# EAGLE schematic SyncScan Standalone MK3 PTH (EAGLE 6.2)
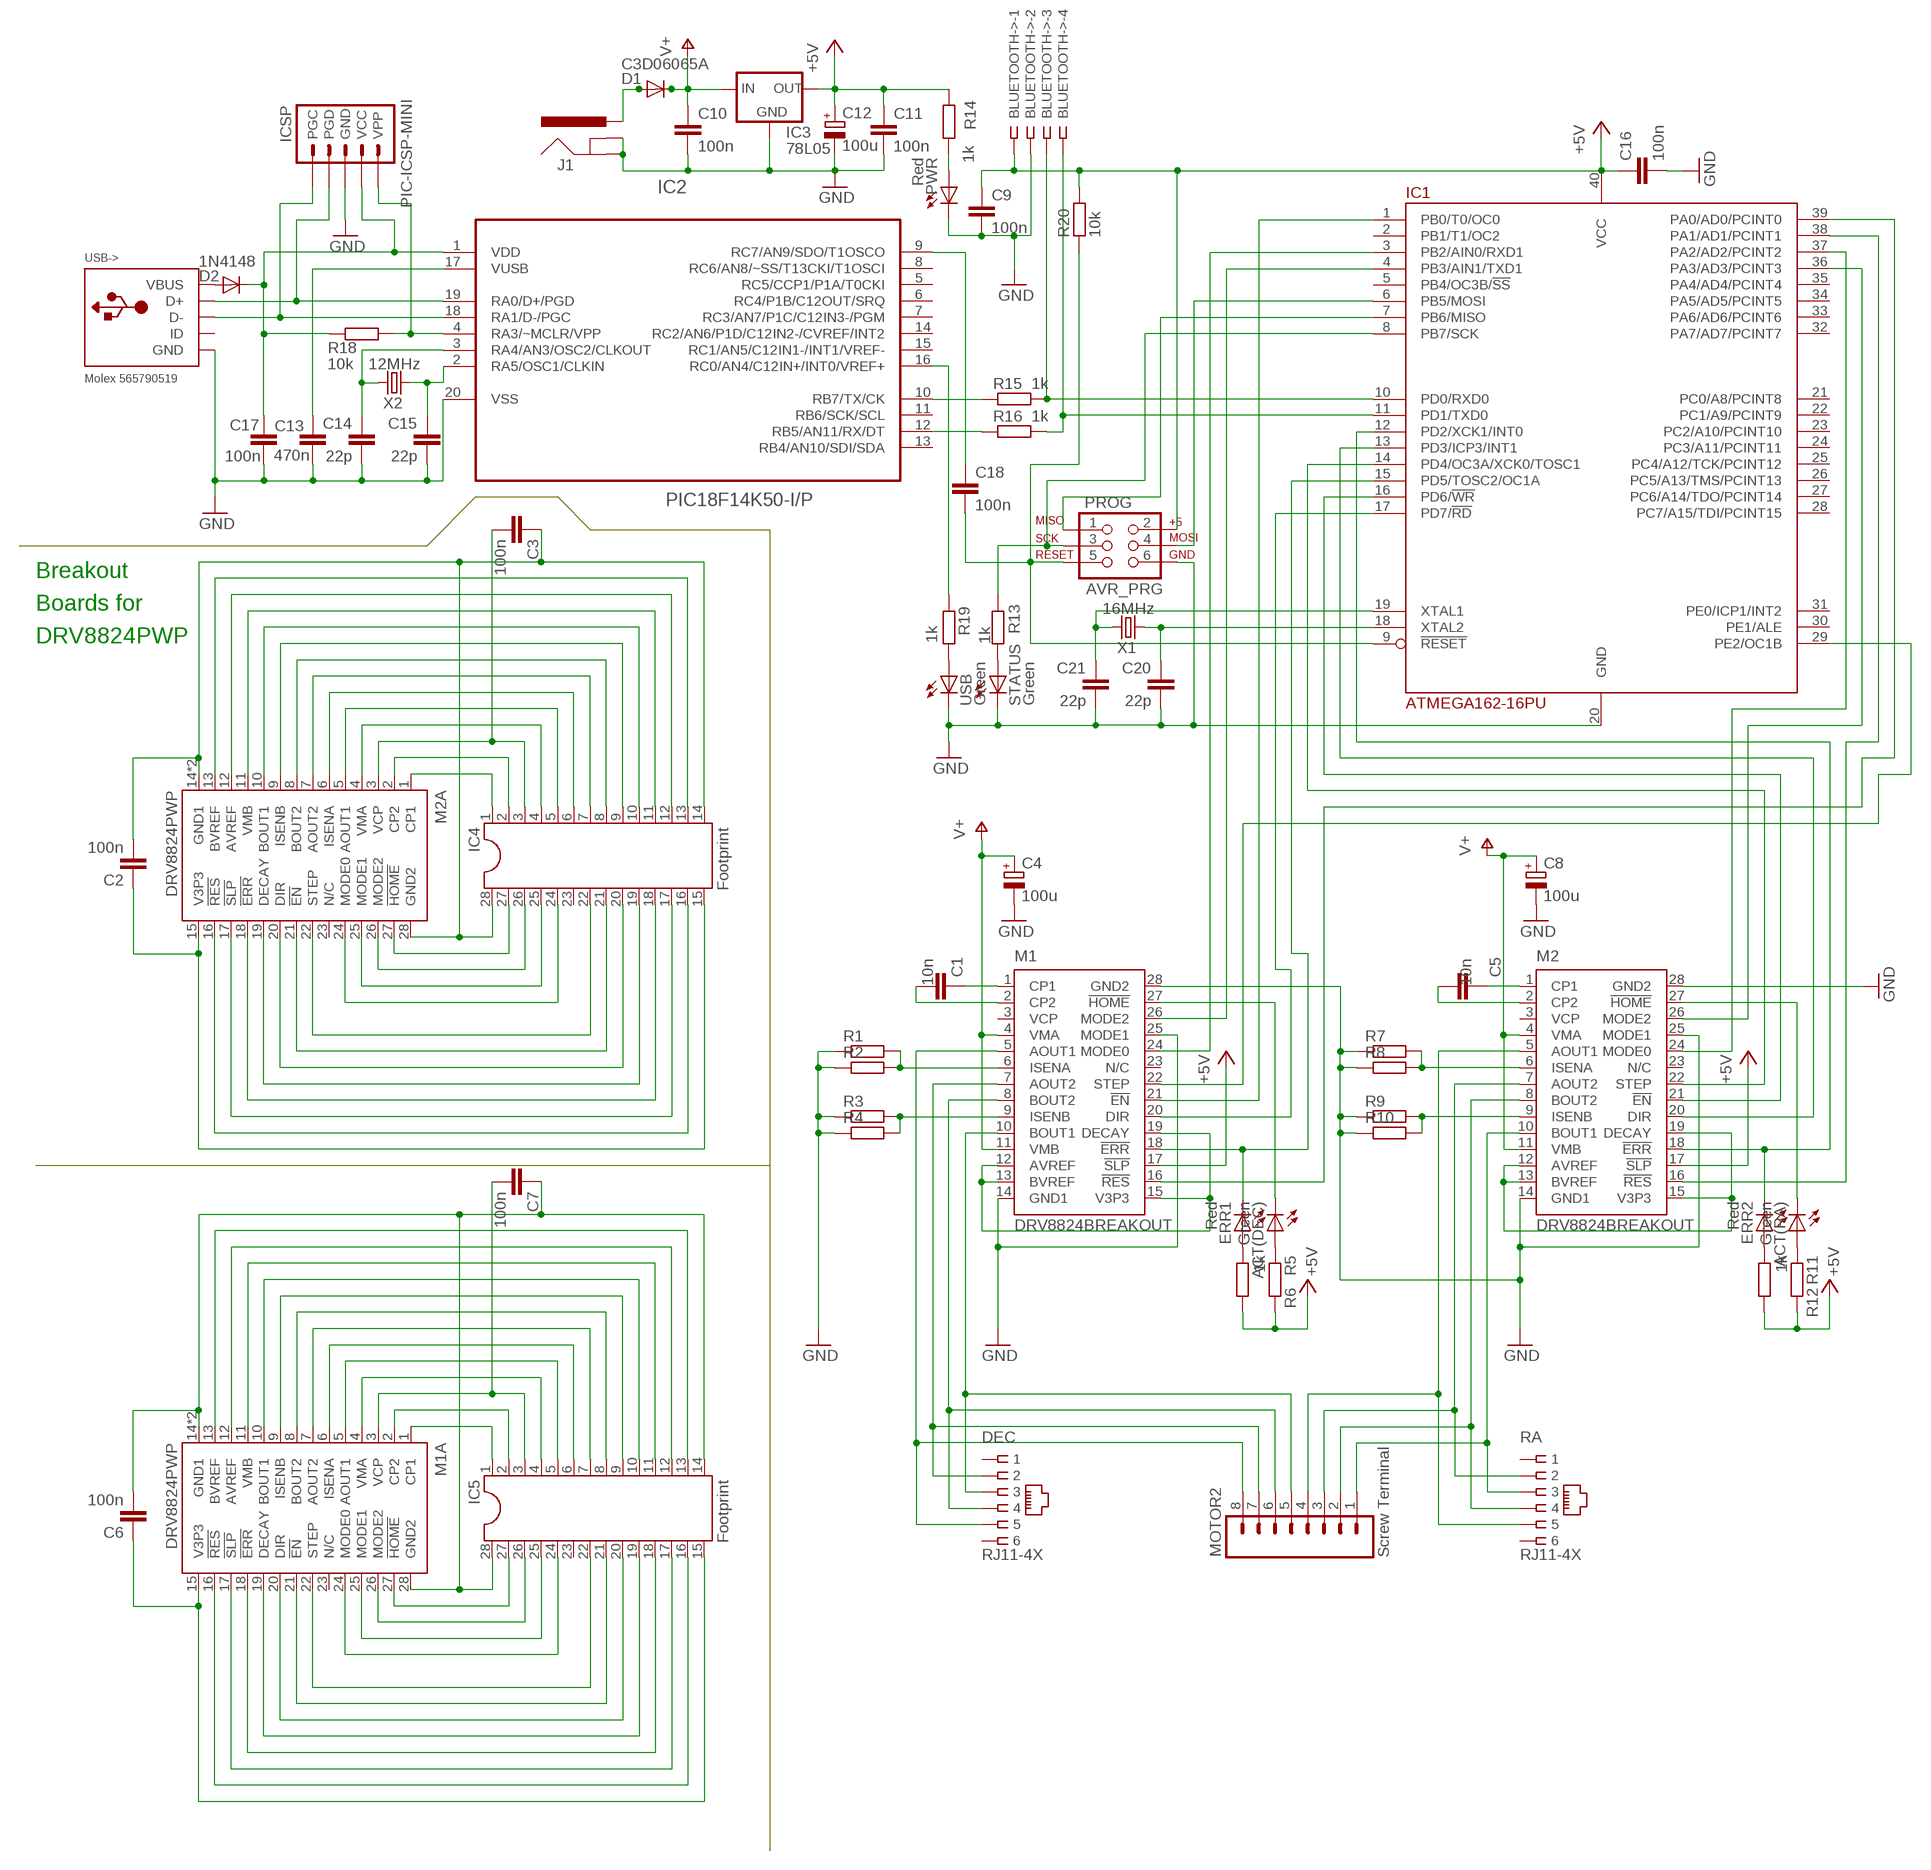
[diagram p0: schematic, sheet 1]

## Parts
ACT(DEC)  Green  LED3MM  [LED3MM]
ACT(RA)  Green  LED3MM  [LED3MM]
BLUETOOTH->  http://www.ebay.co.uk/itm/250991624201  SSW-104-02-S-S-RA  [SSW-104-02-S-S-RA]
C1  10n  C-EU025-024X044  [C025-024X044]
C2  100n  C-EUC0603K  [C0603K]
C3  100n  C-EUC0603K  [C0603K]
C4  100u  CPOL-EUE2.5-6  [E2,5-6]
C5  10n  C-EU025-024X044  [C025-024X044]
C6  100n  C-EUC0603K  [C0603K]
C7  100n  C-EUC0603K  [C0603K]
C8  100u  CPOL-EUE2.5-6  [E2,5-6]
C9  100n  C-EU025-024X044  [C025-024X044]
C10  100n  C-EU025-024X044  [C025-024X044]
C11  100n  C-EU025-024X044  [C025-024X044]
C12  100u  CPOL-EUE2.5-6  [E2,5-6]
C13  470n  C-EU025-024X044  [C025-024X044]
C14  22p  C-EU025-024X044  [C025-024X044]
C15  22p  C-EU025-024X044  [C025-024X044]
C16  100n  C-EU025-024X044  [C025-024X044]
C17  100n  C-EU025-024X044  [C025-024X044]
C18  100n  C-EU025-024X044  [C025-024X044]
C20  22p  C-EU025-024X044  [C025-024X044]
C21  22p  C-EU025-024X044  [C025-024X044]
D1  C3D06065A  BYW80  [TO220ACS]
D2  1N4148  DIODE1N4148  [DIODE-1N4148]
DEC  RJ11-4X  [RJ11-NO_SHIELD]
ERR1  Red  LED3MM  [LED3MM]
ERR2  Red  LED3MM  [LED3MM]
IC1  ATMEGA162-16PU  [DIL40]
IC2  PIC18F14K50-I/P  [DIL20]
IC3  78L05  V_REG_78XXTO-92  [TO-92]
IC4  Footprint  DIL28  [DIL28-6]
IC5  Footprint  DIL28  [DIL28-6]
ICSP  PIC-ICSP-MINI  [PIC-ICSP-MINI]
J1  POWER_JACKPTH  [POWER_JACK_PTH]
M1  DRV8824BREAKOUT  [DIL28-6]
M1A  DRV8824PWP  [HTSSOP28PWP]
M2  DRV8824BREAKOUT  [DIL28-6]
M2A  DRV8824PWP  [HTSSOP28PWP]
MOTOR2  Screw Terminal  M083.5MM-8  [SCREWTERMINAL-3.5MM-8]
PROG  AVR_PRG  AVR_SPI_PRG_6PTH  [2X3]
PWR  Red  LED3MM  [LED3MM]
R1  1.5R  R-EU_0309/12  [0309/12]
R2  1.5R  R-EU_0309/12  [0309/12]
R3  1.5R  R-EU_0309/12  [0309/12]
R4  1.5R  R-EU_0309/12  [0309/12]
R5  1k  R-EU_0204/7  [0204/7]
R6  1k  R-EU_0204/7  [0204/7]
R7  1.5R  R-EU_0309/12  [0309/12]
R8  1.5R  R-EU_0309/12  [0309/12]
R9  1.5R  R-EU_0309/12  [0309/12]
R10  1.5R  R-EU_0309/12  [0309/12]
R11  1k  R-EU_0204/7  [0204/7]
R12  1k  R-EU_0204/7  [0204/7]
R13  1k  R-EU_0204/7  [0204/7]
R14  1k  R-EU_0204/7  [0204/7]
R15  1k  R-EU_0204/7  [0204/7]
R16  1k  R-EU_0204/7  [0204/7]
R18  10k  R-EU_0204/7  [0204/7]
R19  1k  R-EU_0204/7  [0204/7]
R20  10k  R-EU_0204/7  [0204/7]
RA  RJ11-4X  [RJ11-NO_SHIELD]
STATUS  Green  LED3MM  [LED3MM]
USB  Green  LED3MM  [LED3MM]
USB->  Molex 565790519  USBMOLEX  [USB-MINIB-THM-MOLEX]
X1  16MHz  CRYSTALHC49US  [HC49US]
X2  12MHz  CRYSTALHC49US  [HC49US]

## Nets
3.3V-1: M1.12(AVREF) M1.13(BVREF) M1.15(V3P3) M1.19(DECAY)
3.3V-2: M2.12(AVREF) M2.13(BVREF) M2.15(V3P3) M2.19(DECAY)
!EN: IC4.21 M2A.21(!EN)
!EN1: IC5.21 M1A.21(!EN)
!EN-1: IC1.1(PB0/T0/OC0) M1.21(!EN)
!EN-2: IC1.16(PD6/!WR) M2.21(!EN)
!ERR: IC4.18 M2A.18(!ERR)
!ERR1: IC5.18 M1A.18(!ERR)
!ERR-1: ERR1.K(C) IC1.15(PD5/TOSC2/OC1A) M1.18(!ERR)
!ERR-2: ERR2.K(C) IC1.12(PD2/XCK1/INT0) M2.18(!ERR)
!HOME: IC4.27 M2A.27(!HOME)
!HOME1: IC5.27 M1A.27(!HOME)
!HOME-1: ACT(DEC).K(C) M1.27(!HOME)
!HOME-2: ACT(RA).K(C) M2.27(!HOME)
!RES: IC4.16 M2A.16(!RES)
!RES1: IC5.16 M1A.16(!RES)
!RST-1: IC1.39(PA0/AD0/PCINT0) M1.16(!RES)
!RST-2: IC1.38(PA1/AD1/PCINT1) M2.16(!RES)
!SLP: IC4.17 M2A.17(!SLP)
!SLP1: IC5.17 M1A.17(!SLP)
+5V: BLUETOOTH->.1 C9.1 C11.1 C12.+ C16.1 IC1.40(VCC) IC3.1(OUT) M1.17(!SLP) M2.17(!SLP) PROG.2 R5.2 R6.2 R11.2 R12.2 R14.1 R20.2
A1-1: DEC.5 M1.5(AOUT1) MOTOR2.8
A1-2: M2.5(AOUT1) MOTOR2.4 RA.5
A2-1: DEC.2 M1.7(AOUT2) MOTOR2.7
A2-2: M2.7(AOUT2) MOTOR2.3 RA.2
AOUT1: IC4.5 M2A.5(AOUT1)
AOUT2: IC4.7 M2A.7(AOUT2)
AOUT3: IC5.5 M1A.5(AOUT1)
AOUT4: IC5.7 M1A.7(AOUT2)
AVREF: IC4.12 M2A.12(AVREF)
AVREF1: IC5.12 M1A.12(AVREF)
AVROSC1: C21.1 IC1.19(XTAL1) X1.2
AVROSC2: C20.1 IC1.18(XTAL2) X1.1
B1-1: DEC.3 M1.10(BOUT1) MOTOR2.5
B1-2: M2.10(BOUT1) MOTOR2.1 RA.3
B2-1: DEC.4 M1.8(BOUT2) MOTOR2.6
B2-2: M2.8(BOUT2) MOTOR2.2 RA.4
BOUT1: IC4.10 M2A.10(BOUT1)
BOUT2: IC4.8 M2A.8(BOUT2)
BOUT3: IC5.8 M1A.8(BOUT2)
BOUT4: IC5.10 M1A.10(BOUT1)
BVREF: IC4.13 M2A.13(BVREF)
BVREF1: IC5.13 M1A.13(BVREF)
CP1: IC4.1 M2A.1(CP1)
CP1-1: C1.1 M1.1(CP1)
CP1-2: C5.1 M2.1(CP1)
CP2: IC4.2 M2A.2(CP2)
CP2-1: C1.2 M1.2(CP2)
CP2-2: C5.2 M2.2(CP2)
CP3: IC5.1 M1A.1(CP1)
CP4: IC5.2 M1A.2(CP2)
D+: IC2.19(RA0/D+/PGD) ICSP.4(PGD) USB->.D+
D-: IC2.18(RA1/D-/PGC) ICSP.5(PGC) USB->.D-
DECAY: IC4.19 M2A.19(DECAY)
DECAY1: IC5.19 M1A.19(DECAY)
DIR: IC4.20 M2A.20(DIR)
DIR1: IC5.20 M1A.20(DIR)
DIR-1: IC1.17(PD7/!RD) M1.20(DIR)
DIR-2: IC1.13(PD3/ICP3/INT1) M2.20(DIR)
GND: BLUETOOTH->.2 C4.- C8.- C9.2 C10.2 C11.2 C12.- C13.1 C14.2 C15.2 C16.2 C17.2 C20.2 C21.2 IC1.20(GND) IC2.20(VSS) IC3.2(GND) ICSP.3(GND) J1.GND J1.GNDBREAK M1.14(GND1) M1.25(MODE1) M1.28(GND2) M2.14(GND1) M2.25(MODE1) M2.28(GND2) PROG.6 PWR.K(C) R1.1 R2.1 R3.1 R4.1 R7.1 R8.1 R9.1 R10.1 STATUS.K(C) USB->.GND USB.K(C)
GND1: C6.2 C7.1 IC5.14 IC5.28 M1A.14(GND1) M1A.28(GND2) M1A.EXP(GND1)
GND2: C2.2 C3.1 IC4.14 IC4.28 M2A.14(GND1) M2A.28(GND2) M2A.EXP(GND1)
ISENA: IC4.6 M2A.6(ISENA)
ISENA1: IC5.6 M1A.6(ISENA)
ISENA-1: M1.6(ISENA) R1.2 R2.2
ISENA-2: M2.6(ISENA) R7.2 R8.2
ISENB: IC4.9 M2A.9(ISENB)
ISENB1: IC5.9 M1A.9(ISENB)
ISENB-1: M1.9(ISENB) R3.2 R4.2
ISENB-2: M2.9(ISENB) R9.2 R10.2
LED1: ERR1.A R6.1
LED2: ACT(DEC).A R5.1
LED3: ERR2.A R12.1
LED4: ACT(RA).A R11.1
M0-1: IC1.3(PB2/AIN0/RXD1) M1.24(MODE0)
M0-2: IC1.37(PA2/AD2/PCINT2) M2.24(MODE0)
M2-1: IC1.4(PB3/AIN1/TXD1) M1.26(MODE2)
M2-2: IC1.36(PA3/AD3/PCINT3) M2.26(MODE2)
MCLR: IC2.4(RA3/~MCLR/VPP) ICSP.1(VPP) R18.1
MISO: IC1.7(PB6/MISO) PROG.1
MODE0: IC4.24 M2A.24(MODE0)
MODE1: IC4.25 M2A.25(MODE1)
MODE2: IC4.26 M2A.26(MODE2)
MODE3: IC5.24 M1A.24(MODE0)
MODE4: IC5.25 M1A.25(MODE1)
MODE5: IC5.26 M1A.26(MODE2)
MOSI: IC1.6(PB5/MOSI) PROG.4
N$1: C18.1 IC2.9(RC7/AN9/SDO/T1OSCO)
PWRLED: PWR.A R14.2
RESET: C18.2 IC1.9(!RESET) PROG.5 R20.1
RX(BTH): BLUETOOTH->.4 IC1.11(PD1/TXD0) R16.1
RX(USB): IC2.12(RB5/AN11/RX/DT) R16.2
SCLK: IC1.8(PB7/SCK) PROG.3 R13.1
STATLED: R13.2 STATUS.A
STEP: IC4.22 M2A.22(STEP)
STEP1: IC5.22 M1A.22(STEP)
STEP-1: IC1.29(PE2/OC1B) M1.22(STEP)
STEP-2: IC1.14(PD4/OC3A/XCK0/TOSC1) M2.22(STEP)
TX(BTH): BLUETOOTH->.3 IC1.10(PD0/RXD0) R15.1
TX(USB): IC2.10(RB7/TX/CK) R15.2
USBLED: R19.1 USB.A
USBOSC1: C15.1 IC2.2(RA5/OSC1/CLKIN) X2.1
USBOSC2: C14.1 IC2.3(RA4/AN3/OSC2/CLKOUT) X2.2
USBSTAT: IC2.16(RC0/AN4/C12IN+/INT0/VREF+) R19.2
V3P1: C6.1 IC5.15 M1A.15(V3P3)
V3P3: C2.1 IC4.15 M2A.15(V3P3)
V+: C4.+ C8.+ C10.1 D1.C IC3.3(IN) M1.4(VMA) M1.11(VMB) M2.4(VMA) M2.11(VMB)
VBUS: D2.A USB->.VBUS
VCP: C3.2 IC4.3 M2A.3(VCP)
VCP1: C7.2 IC5.3 M1A.3(VCP)
VIN: D1.A J1.PWR
VMA: IC4.4 M2A.4(VMA)
VMA1: IC5.4 M1A.4(VMA)
VMB: IC4.11 M2A.11(VMB)
VMB1: IC5.11 M1A.11(VMB)
VPIC: C17.1 D2.C IC2.1(VDD) ICSP.2(VCC) R18.2
VUSB: C13.2 IC2.17(VUSB)
Unconnected: DEC.1 DEC.6 IC1.2(PB1/T1/OC2) IC1.5(PB4/OC3B/!SS) IC1.21(PC0/A8/PCINT8) IC1.22(PC1/A9/PCINT9) IC1.23(PC2/A10/PCINT10) IC1.24(PC3/A11/PCINT11) IC1.25(PC4/A12/TCK/PCINT12) IC1.26(PC5/A13/TMS/PCINT13) IC1.27(PC6/A14/TDO/PCINT14) IC1.28(PC7/A15/TDI/PCINT15) IC1.30(PE1/ALE) IC1.31(PE0/ICP1/INT2) IC1.32(PA7/AD7/PCINT7) IC1.33(PA6/AD6/PCINT6) IC1.34(PA5/AD5/PCINT5) IC1.35(PA4/AD4/PCINT4) IC2.5(RC5/CCP1/P1A/T0CKI) IC2.6(RC4/P1B/C12OUT/SRQ) IC2.7(RC3/AN7/P1C/C12IN3-/PGM) IC2.8(RC6/AN8/~SS/T13CKI/T1OSCI) IC2.11(RB6/SCK/SCL) IC2.13(RB4/AN10/SDI/SDA) IC2.14(RC2/AN6/P1D/C12IN2-/CVREF/INT2) IC2.15(RC1/AN5/C12IN1-/INT1/VREF-) IC4.23 IC5.23 M1.3(VCP) M1.23(N/C) M1A.23(N/C) M2.3(VCP) M2.23(N/C) M2A.23(N/C) RA.1 RA.6 USB->.ID

## Notes on the sheet
- Breakout
- Boards for
- DRV8824PWP

## Library data of the parts
ACT(DEC) ACT(RA) STATUS USB = led:LED: LED OSRAM: - CHIPLED LG R971, LG N971, LY N971, LG Q971, LY Q971, LO R971, LY R971 LH N974, LH R974 LS Q976, LO Q976, LY Q976 LO Q996 - Hyper CHIPLED LW Q18S LB Q993, LB Q99A, LB R99A - SideLED LS A670, LO A670, LY A670, LG A670, LP A670 LB A673, LV A673, LT A673, LW A673 LH A674 LY A675 LS A676, LA A676, LO A676, LY A676, LW A676 LS A679, LY A679, LG A679 - Hyper Micro SIDELED® LS Y876, LA Y876, LO Y876, LY Y876 LT Y87S - SmartLED LW L88C, LW L88S LB L89C, LB L89S, LG L890 LS L89K, LO L89K, LY L89K LS L896, LA L896, LO L896, LY L896 - TOPLED LS T670, LO T670, LY T670, LG T670, LP T670 LSG T670, LSP T670, LSY T670, LOP T670, LYG T670 LG T671, LOG T671, LSG T671 LB T673, LV T673, LT T673, LW T673 LH T674 LS T676, LA T676, LO T676, LY T676, LB T676, LH T676, LSB T676, LW T676 LB T67C, LV T67C, LT T67C, LS T67K, LO T67K, LY T67K, LW E67C LS E67B, LA E67B, LO E67B, LY E67B, LB E67C, LV E67C, LT E67C LW T67C LS T679, LY T679, LG T679 LS T770, LO T770, LY T770, LG T770, LP T770 LB T773, LV T773, LT T773, LW T773 LH T774 LS E675, LA E675, LY E675, LS T675 LS T776, LA T776, LO T776, LY T776, LB T776 LHGB T686 LT T68C, LB T68C - Hyper Mini TOPLED® LB M676 - Mini TOPLED Santana® LG M470 LS M47K, LO M47K, LY M47K Source: http://www.osram.convergy.de/; MF: KINGBRIGHT; MPN: L-424GDT; OC_FARNELL: 1142496
BLUETOOTH-> = con-samtec:SSW-104-02-S-S: THROUGH-HOLE .025" SQ POST SOCKET Source: Samtec SSW.pdf; OC_FARNELL: unknown; OC_NEWARK: 11P9385
C1 C5 = resistor:C-EU: CAPACITOR, European symbol; MF: AVX; MPN: SR151C103KAR; OC_FARNELL: 1100380
C2 C3 C6 C7 = resistor:C-EU: CAPACITOR, European symbol; MF: KEMET; MPN: C0603C104K4RACTU; OC_FARNELL: 1414610
C4 C8 C12 = resistor:CPOL-EU: POLARIZED CAPACITOR, European symbol; MF: MULTICOMP; MPN: MCGPR25V107M6.3X11; OC_FARNELL: 9451188
C9-C11 C16-C18 = resistor:C-EU: CAPACITOR, European symbol; MF: AVX; MPN: SR205C104KAR; OC_FARNELL: 1100367
C13 = rcl:C-EU: CAPACITOR, European symbol; MF: KEMET; MPN: C320C474M5U5TA; OC_FARNELL: 1457660
C14 C15 C20 C21 = rcl:C-EU: CAPACITOR, European symbol; MF: AVX; MPN: SR151A220JAR; OC_FARNELL: 1100369
D1 = diode:BYW80: DIODE high-efficiency fast recovery rectifier (ST); MF: CREE; MPN: C3D06065A; OC_FARNELL: 1864928
D2 = SparkFun:DIODE: Diode These are standard reverse protection diodes and small signal diodes. SMA package can handle up to about 1A. SOD-323 can handle about 200mA. What the SOD-323 package when ordering, there are some mfgs out there that are 5-pin packages.; MF: MULTICOMP; MPN: 1N4148.; OC_FARNELL: 9565124
DEC RA = con-tycoelectronics:RJ11: CORCOM Modular RJ Jacks No Shield Source: www.tycoelectronics.com .. ENG_DS_1654001_1099_RJ_L_0507.pdf; MF: MH CONNECTORS; MPN: MHRJJ64NFRA; OC_FARNELL: 3938347; OC_NEWARK: 19R7022
ERR1 ERR2 PWR = led:LED: LED OSRAM: - CHIPLED LG R971, LG N971, LY N971, LG Q971, LY Q971, LO R971, LY R971 LH N974, LH R974 LS Q976, LO Q976, LY Q976 LO Q996 - Hyper CHIPLED LW Q18S LB Q993, LB Q99A, LB R99A - SideLED LS A670, LO A670, LY A670, LG A670, LP A670 LB A673, LV A673, LT A673, LW A673 LH A674 LY A675 LS A676, LA A676, LO A676, LY A676, LW A676 LS A679, LY A679, LG A679 - Hyper Micro SIDELED® LS Y876, LA Y876, LO Y876, LY Y876 LT Y87S - SmartLED LW L88C, LW L88S LB L89C, LB L89S, LG L890 LS L89K, LO L89K, LY L89K LS L896, LA L896, LO L896, LY L896 - TOPLED LS T670, LO T670, LY T670, LG T670, LP T670 LSG T670, LSP T670, LSY T670, LOP T670, LYG T670 LG T671, LOG T671, LSG T671 LB T673, LV T673, LT T673, LW T673 LH T674 LS T676, LA T676, LO T676, LY T676, LB T676, LH T676, LSB T676, LW T676 LB T67C, LV T67C, LT T67C, LS T67K, LO T67K, LY T67K, LW E67C LS E67B, LA E67B, LO E67B, LY E67B, LB E67C, LV E67C, LT E67C LW T67C LS T679, LY T679, LG T679 LS T770, LO T770, LY T770, LG T770, LP T770 LB T773, LV T773, LT T773, LW T773 LH T774 LS E675, LA E675, LY E675, LS T675 LS T776, LA T776, LO T776, LY T776, LB T776 LHGB T686 LT T68C, LB T68C - Hyper Mini TOPLED® LB M676 - Mini TOPLED Santana® LG M470 LS M47K, LO M47K, LY M47K Source: http://www.osram.convergy.de/; MF: KINGBRIGHT; MPN: L-424HDT; OC_FARNELL: 1142499
IC1 = atmel:ATMEGA162: 8-bit RISC MICROCONTROLLER 16K Bytes internal flash program memory 1K Bytes internal SRAM Upto 64K Bytes optional external memory space 512 Bytes EEPROM Two 8-bit timers Two 16-bit timers Dual programmable serial USARTs Master/Slave serial SPI interface Source: ATMEGA162_DIP40.lbr; MF: ATMEL; MPN: ATMEGA162-16PU; OC_FARNELL: 9171169
IC2 = microchip:PIC18F14K50-I/P: USB Flash Microcontrollers; MF: MICROCHIP; MPN: PIC18F14K50-I/P; OC_FARNELL: 1648501; OC_NEWARK: 77M3103; PACKAGE: DIP-20; SUPPLIER: Microchip
IC3 = SparkFun:V_REG_78XX: Voltage Regulator Standard 7805 5V regulator. IGO (Input Ground Output). Spark Fun Electronics SKU : COM-00107; MF: FAIRCHILD SEMICONDUCTOR; MPN: LM78L05ACZX; OC_FARNELL: 1467367
IC4 IC5 = ic-package:DIL28: Dual In Line; MF: MULTICOMP; MPN: MC34735; OC_FARNELL: 1593421
ICSP = SparkFun:PIC-ICSP-MINI: PIC-ICSP-Mini Miniature 5-pin connection for temporary programming of PICs. Use this device in your design to save space. Program the PIC with this adapter Spark Fun Electronics SKU : BOB-00194; OC_FARNELL: unknown
J1 = SparkFun:POWER_JACK: Power Jack This is the standard 5.5mm barrel jack for power. The PTH is the most common, proven, reliable, footprint. All others are experimental. The Slot footprint only works if the mill layer is transmitted to the PCB fab house so be warned. Spark Fun Electronics SKU : PRT-00119. Mating wall wart : TOL-00298 (and others); MF: MULTICOMP; MPN: MJ-179PH; OC_FARNELL: 1737246
M1 M2 = texas:DRV8824; MF: MULTICOMP; MPN: MC-2227-28-06-F1; OC_FARNELL: 1182591
M1A M2A = texas:DRV8824; MF: TEXAS INSTRUMENTS; MPN: DRV8824PWP; OC_FARNELL: 1815786
MOTOR2 = SparkFun:M08: Header 8 Standard 8-pin 0.1" header. Use with straight break away headers (SKU : PRT-00116), right angle break away headers (PRT-00553), swiss pins (PRT-00743), machine pins (PRT-00117), and female headers (PRT-00115).; MF: LUMBERG; MPN: KRMC 08; OC_FARNELL: 1217307
PROG = SparkFun:AVR_SPI_PRG_6: AVR ISP 6 Pin This is the reduced ISP connector for AVR programming. Common on Arduino. This footprint will take up less PCB space and can be used with a 10-pin to 6-pin adapter such as SKU: BOB-08508; MF: TE CONNECTIVITY / AMP; MPN: 826632-3; OC_FARNELL: 3418492
R1-R4 R7-R10 = resistor:R-EU_: RESISTOR, European symbol; MF: WELWYN; MPN: MFP1-1R5 JI; OC_FARNELL: 1565361
R5 R6 R11 R12 = resistor:R-EU_: RESISTOR, European symbol; MF: MULTICOMP; MPN: MF12 1K; OC_FARNELL: 9342400
R13 R14 R19 = rcl:R-EU_: RESISTOR, European symbol; MF: MULTICOMP; MPN: MF12 1K; OC_FARNELL: 9342400
R15 R16 = SmartPrj:R-EU_: RESISTOR, European symbol; MF: MULTICOMP; MPN: MF12 1K; OC_FARNELL: 9342400
R18 R20 = rcl:R-EU_: RESISTOR, European symbol; MF: MULTICOMP; MPN: MF12 10K; OC_FARNELL: 9342419
USB-> = adafruit:USB: USB Connectors USBMINIB - Surface Mount Female Mini-B USB Connector 4UConnector: 06564 By microbuilder.eu Thru-hole RA Female Mini-B USB Connector 4UConnector: 18732 By ladyada.net; MF: MOLEX; MPN: 565790519; OC_FARNELL: 1125347
X1 = SparkFun:CRYSTAL: Crystals Various standard crystals. Proven footprints. Spark Fun Electronics SKU : COM-00534; MF: TXC; MPN: 9B-16.000MEEJ-B; OC_FARNELL: 1842217
X2 = SparkFun:CRYSTAL: Crystals Various standard crystals. Proven footprints. Spark Fun Electronics SKU : COM-00534; MF: TXC; MPN: 9B-12.000MAAJ-B; OC_FARNELL: 1842203

## Net classes
1 power: width 0.61 mm, drill 0.711 mm, clearance 0.203 mm
2 gnd: width 0.305 mm, drill 0.711 mm, clearance 0.203 mm
3 usbvcc: width 0.508 mm, drill 0.711 mm, clearance 0.203 mm